# EAGLE schematic TopPanelV4 (EAGLE 7.6.0)
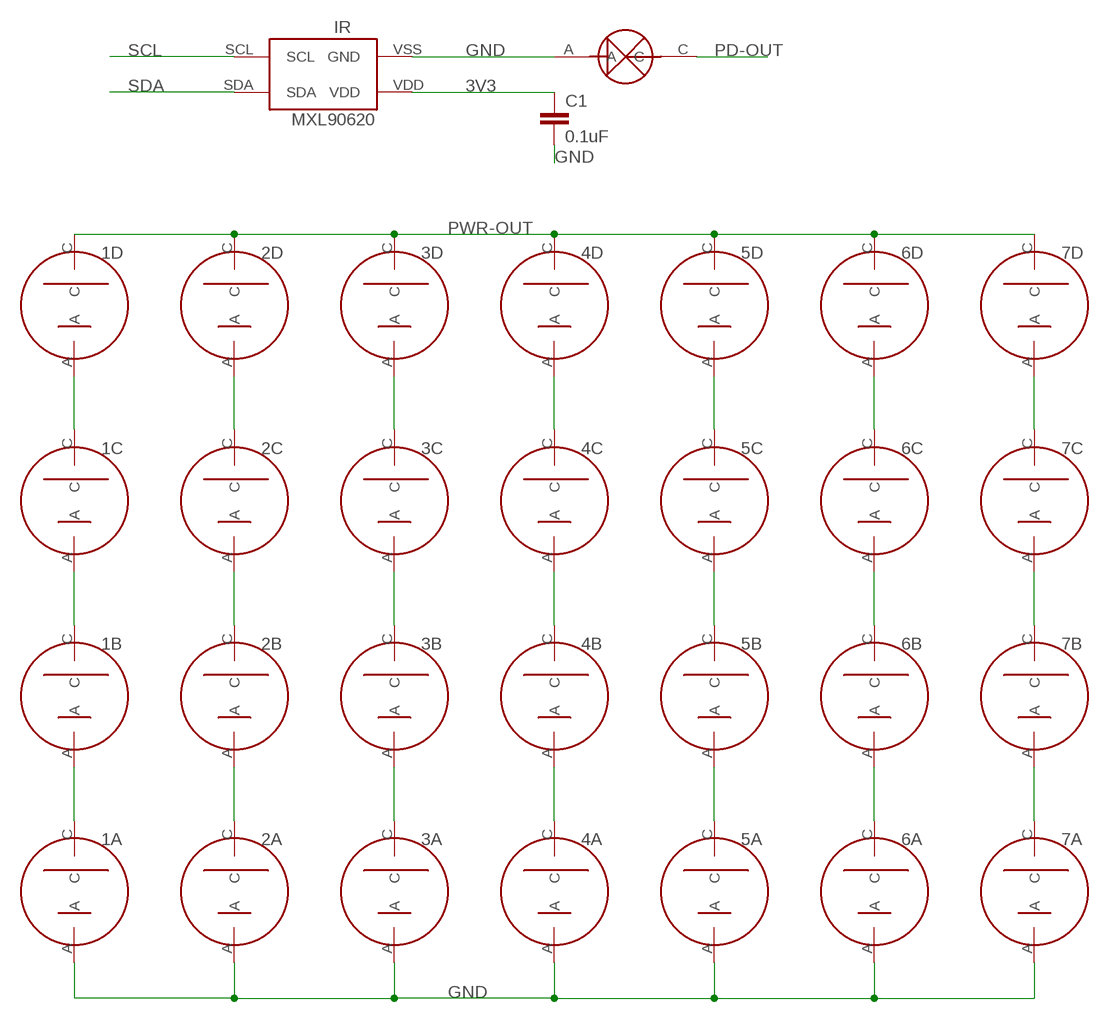
[diagram p0: schematic, sheet 1]

## Parts
1A  NEWSOLARPANEL  [SOLARCELL2]
1B  NEWSOLARPANEL  [SOLARCELL2]
1C  NEWSOLARPANEL  [SOLARCELL2]
1D  NEWSOLARPANEL  [SOLARCELL2]
2A  NEWSOLARPANEL  [SOLARCELL2]
2B  NEWSOLARPANEL  [SOLARCELL2]
2C  NEWSOLARPANEL  [SOLARCELL2]
2D  NEWSOLARPANEL  [SOLARCELL2]
3A  NEWSOLARPANEL  [SOLARCELL2]
3B  NEWSOLARPANEL  [SOLARCELL2]
3C  NEWSOLARPANEL  [SOLARCELL2]
3D  NEWSOLARPANEL  [SOLARCELL2]
4A  NEWSOLARPANEL  [SOLARCELL2]
4B  NEWSOLARPANEL  [SOLARCELL2]
4C  NEWSOLARPANEL  [SOLARCELL2]
4D  NEWSOLARPANEL  [SOLARCELL2]
5A  NEWSOLARPANEL  [SOLARCELL2]
5B  NEWSOLARPANEL  [SOLARCELL2]
5C  NEWSOLARPANEL  [SOLARCELL2]
5D  NEWSOLARPANEL  [SOLARCELL2]
6A  NEWSOLARPANEL  [SOLARCELL2]
6B  NEWSOLARPANEL  [SOLARCELL2]
6C  NEWSOLARPANEL  [SOLARCELL2]
6D  NEWSOLARPANEL  [SOLARCELL2]
7A  NEWSOLARPANEL  [SOLARCELL2]
7B  NEWSOLARPANEL  [SOLARCELL2]
7C  NEWSOLARPANEL  [SOLARCELL2]
7D  NEWSOLARPANEL  [SOLARCELL2]
C1  0.1uF  CAP0805  [0805]
IR  MXL90620  [MXL90620]
PD  PHOTODETECTOR  [PHOTODECTORDEVICE2]

## Nets
2D: 2C.C 2D.A
3V3: C1.1 IR.VDD
GND: 1A.A 2A.A 3A.A 4A.A 5A.A 6A.A 7A.A C1.2 IR.VSS(GND) PD.A
N$1: 1A.C 1B.A
N$2: 1B.C 1C.A
N$3: 1C.C 1D.A
N$4: 7A.C 7B.A
N$5: 7B.C 7C.A
N$6: 2A.C 2B.A
N$7: 2B.C 2C.A
N$8: 7C.C 7D.A
N$11: 3A.C 3B.A
N$12: 3B.C 3C.A
N$13: 3C.C 3D.A
N$16: 4A.C 4B.A
N$17: 4B.C 4C.A
N$18: 4C.C 4D.A
N$21: 5A.C 5B.A
N$22: 5B.C 5C.A
N$23: 5C.C 5D.A
N$26: 6A.C 6B.A
N$27: 6B.C 6C.A
N$28: 6C.C 6D.A
PD-OUT: PD.C
PWR-OUT: 1D.C 2D.C 3D.C 4D.C 5D.C 6D.C 7D.C
SCL: IR.SCL
SDA: IR.SDA

## Library data of the parts
1A 1B 1C 1D 2A 2B 2C 2D 3A 3B 3C 3D 4A 4B 4C 4D 5A 5B 5C 5D 6A 6B 6C 6D 7A 7B 7C 7D = Solar Panel Parts:NEWSOLARPANEL
C1 = CNTRL_BOARD:CAP: Capacitor Standard 0603 ceramic capacitor, and 0.1" leaded capacitor.
IR = CNTRL_BOARD:MXL90620
PD = Solar Panel Parts:PHOTODETECTOR